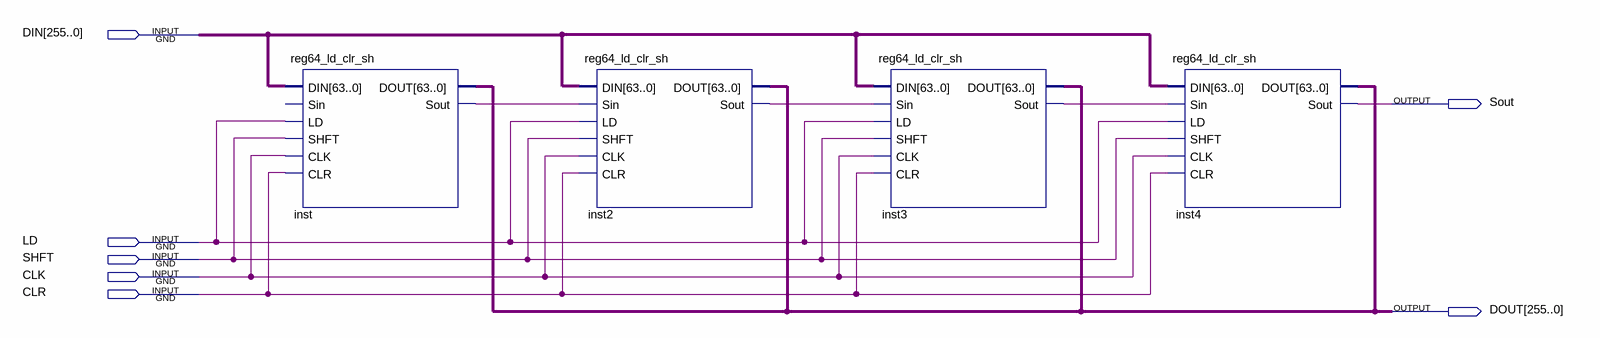
[diagram p0: schematic sheet]
// Quartus schematic reg256_ld_clr_sh.bdf as structural Verilog: 4 symbols, 7 pins
module reg256_ld_clr_sh (
  input  [255:0] DIN,
  input  LD,
  input  SHFT,
  input  CLK,
  input  CLR,
  output Sout,
  output [255:0] DOUT
);

  wire inst2_sout, inst3_sout, inst_sout;

  reg64_ld_clr_sh inst (
    .DIN(DIN[255:192]), .LD(LD), .SHFT(SHFT), .CLK(CLK), .CLR(CLR), .Sout(inst_sout), .DOUT(DOUT[255:192]));  // open: Sin
  reg64_ld_clr_sh inst2 (
    .DIN(DIN[191:128]), .Sin(inst_sout), .LD(LD), .SHFT(SHFT), .CLK(CLK), .CLR(CLR), .Sout(inst2_sout),
    .DOUT(DOUT[191:128]));
  reg64_ld_clr_sh inst3 (
    .DIN(DIN[127:64]), .Sin(inst2_sout), .LD(LD), .SHFT(SHFT), .CLK(CLK), .CLR(CLR), .Sout(inst3_sout),
    .DOUT(DOUT[127:64]));
  reg64_ld_clr_sh inst4 (
    .DIN(DIN[63:0]), .Sin(inst3_sout), .LD(LD), .SHFT(SHFT), .CLK(CLK), .CLR(CLR), .Sout(Sout),
    .DOUT(DOUT[63:0]));
endmodule
